# EAGLE design CommsTestBoard (EAGLE 9.6.2)
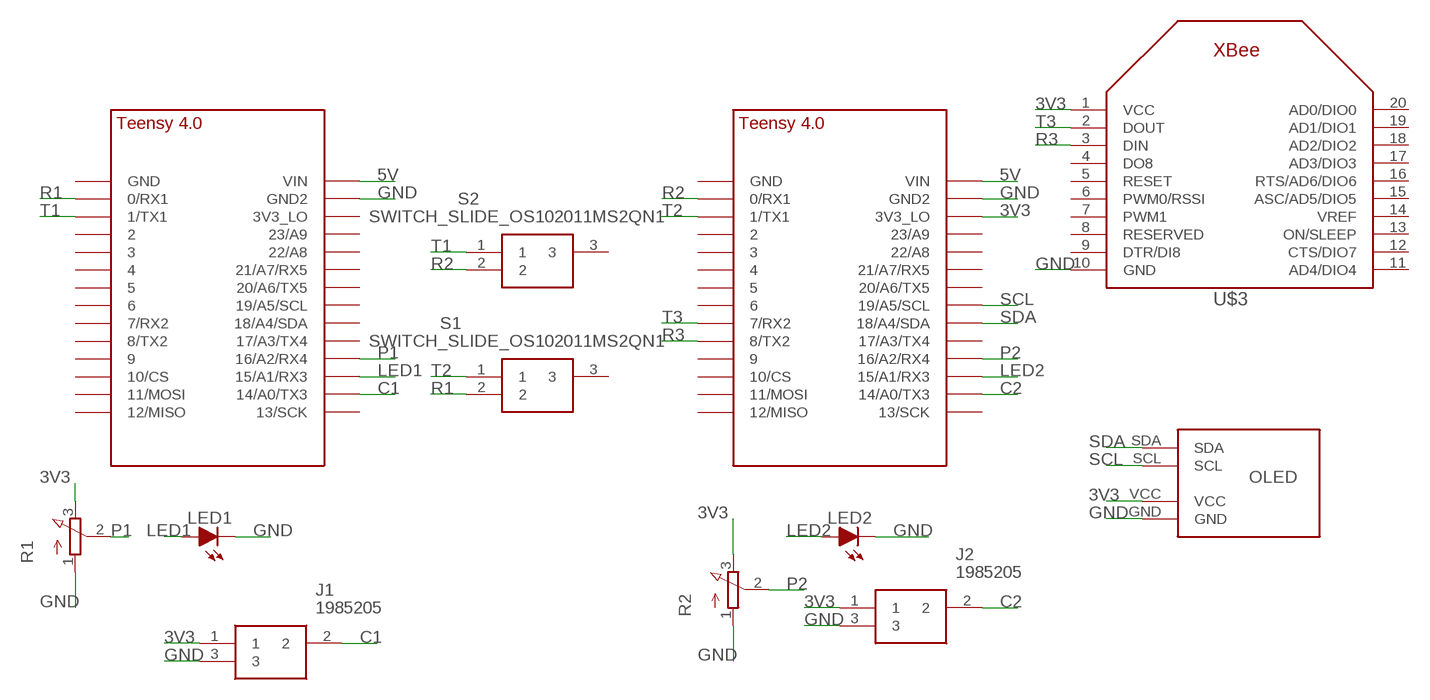
[diagram p0: schematic, sheet 1]

## Parts
J1  1985205  [1985205]
J2  1985205  [1985205]
LED1  LED-5MM  [LED-5MM]
LED2  LED-5MM  [LED-5MM]
R1  POTENTIOMETER  [3RP/1610N]
R2  POTENTIOMETER  [3RP/1610N]
S1  SWITCH_SLIDE_OS102011MS2QN1  [OS102011MA1QN1]
S2  SWITCH_SLIDE_OS102011MS2QN1  [OS102011MA1QN1]
U$1  TEENSY_4.0_SIMPLE  [TEENSY_4.0_SIMPLE]
U$2  TEENSY_4.0_SIMPLE  [TEENSY_4.0_SIMPLE]
U$3  XBEE  [XBEE]
U$4  OLED_SSD1306  [OLED_SSD1306]

## Nets
3V3: J1.1 J2.1 R1.3(E) R2.3(E) U$2.3V3_LO U$3.1(VCC) U$4.VCC
5V: U$1.VIN U$2.VIN
C1: J1.2 U$1.14/A0(14/A0/TX3)
C2: J2.2 U$2.14/A0(14/A0/TX3)
GND: J1.3 J2.3 LED1.K(C) LED2.K(C) R1.1(A) R2.1(A) U$1.GND2 U$2.GND2 U$3.10(GND) U$4.GND
LED1: LED1.A U$1.15/A1(15/A1/RX3)
LED2: LED2.A U$2.15/A1(15/A1/RX3)
P1: R1.2(S) U$1.16/A2(16/A2/RX4)
P2: R2.2(S) U$2.16/A2(16/A2/RX4)
R1: S1.2 U$1.0/RX(0/RX1)
R2: S2.2 U$2.0/RX(0/RX1)
R3: U$2.8(8/TX2) U$3.3(DIN)
SCL: U$2.19/A5/SCL U$4.SCL
SDA: U$2.18/A4/SDA U$4.SDA
T1: S2.1 U$1.1/TX(1/TX1)
T2: S1.1 U$2.1/TX(1/TX1)
T3: U$2.7(7/RX2) U$3.2(DOUT)
Unconnected: S1.3 S2.3 U$1.2 U$1.3/CANTX U$1.3V3_LO U$1.4/CANRX U$1.5 U$1.6 U$1.7(7/RX2) U$1.8(8/TX2) U$1.9/CS U$1.10/CS U$1.11/MOSI U$1.12/MISO U$1.13/SCK U$1.17/A3(17/A3/TX4) U$1.18/A4/SDA U$1.19/A5/SCL U$1.20/A6(20/A6/TX5) U$1.21/A7(21/A7/RX5) U$1.22/A8 U$1.23/A9 U$1.GND U$2.2 U$2.3/CANTX U$2.4/CANRX U$2.5 U$2.6 U$2.9/CS U$2.10/CS U$2.11/MOSI U$2.12/MISO U$2.13/SCK U$2.17/A3(17/A3/TX4) U$2.20/A6(20/A6/TX5) U$2.21/A7(21/A7/RX5) U$2.22/A8 U$2.23/A9 U$2.GND U$3.4(DO8) U$3.5(RESET) U$3.6(PWM0/RSSI) U$3.7(PWM1) U$3.8(RESERVED) U$3.9(DTR/DI8) U$3.11(AD4/DIO4) U$3.12(CTS/DIO7) U$3.13(ON/SLEEP) U$3.14(VREF) U$3.15(ASC/AD5/DIO5) U$3.16(RTS/AD6/DIO6) U$3.17(AD3/DIO3) U$3.18(AD2/DIO2) U$3.19(AD1/DIO1) U$3.20(AD0/DIO0)

## Library data of the parts
J1 J2 = GTOR - Connectors:1985205: Fixed Terminal Blocks PTSA 1.5/3-3.5-Z Source: Datasheet <https://componentsearchengine.com/Datasheets/1/1985205.pdf>; ARROW_PART_NUMBER: 1985205; ARROW_PRICE-STOCK: https://www.arrow.com/en/products/1985205/phoenix-contact; DESCRIPTION: Fixed Terminal Blocks PTSA 1.5/3-3.5-Z; HEIGHT: 13mm; MANUFACTURER_NAME: Phoenix Contact; MANUFACTURER_PART_NUMBER: 1985205; MOUSER_PART_NUMBER: 651-1985205; MOUSER_PRICE-STOCK: https://www.mouser.co.uk/ProductDetail/Phoenix-Contact/1985205?qs=JcjeNNoqGSNoFnucoMlHJQ%3D%3D
LED1 LED2 = GTOR - Passive Components:LED: Light Emitting Diode (LED) Source: Dangerous Prototypes Eagle Library <https://github.com/DangerousPrototypes/Eagle_Part_Library>
R1 R2 = GTOR - Passive Components:POTENTIOMETER: 16mm Potentiometer one level Source: http://www.alphapotentiometers.net/html/16mm_pot_2.html
S1 S2 = GTOR - Active Components:SWITCH_SLIDE_OS102011MS2QN1: Switch Slide Miniature SPDT 0.1A 12VDC Through Hole Slide Switch SPDT On-On 0.1 A@ 12 V dc Slide Source: Datasheet <http://www.ckswitches.com/media/1428/os.pdf>; ARROW_PART_NUMBER: OS102011MS2QN1; ARROW_PRICE-STOCK: https://www.arrow.com/en/products/os102011ms2qn1/ck; DESCRIPTION: Switch Slide Miniature SPDT 0.1A 12VDC Through Hole Slide Switch SPDT On-On 0.1 A@ 12 V dc Slide; HEIGHT: mm; MANUFACTURER_NAME: C & K COMPONENTS; MANUFACTURER_PART_NUMBER: OS102011MS2QN1; MOUSER_PART_NUMBER: 611-OS102011MS2QN1; MOUSER_PRICE-STOCK: https://www.mouser.co.uk/ProductDetail/CK/OS102011MS2QN1?qs=WtljUlYws5RvQ1hEv876nQ%3D%3D
U$1 U$2 = GTOR - Microcontroller:TEENSY_4.0_SIMPLE
U$3 = GTOR - Microcontroller:XBEE: Source: Adafruit <https://github.com/adafruit/Adafruit-Eagle-Library>
U$4 = GTOR - Breakout Boards:OLED_SSD1306

## Board
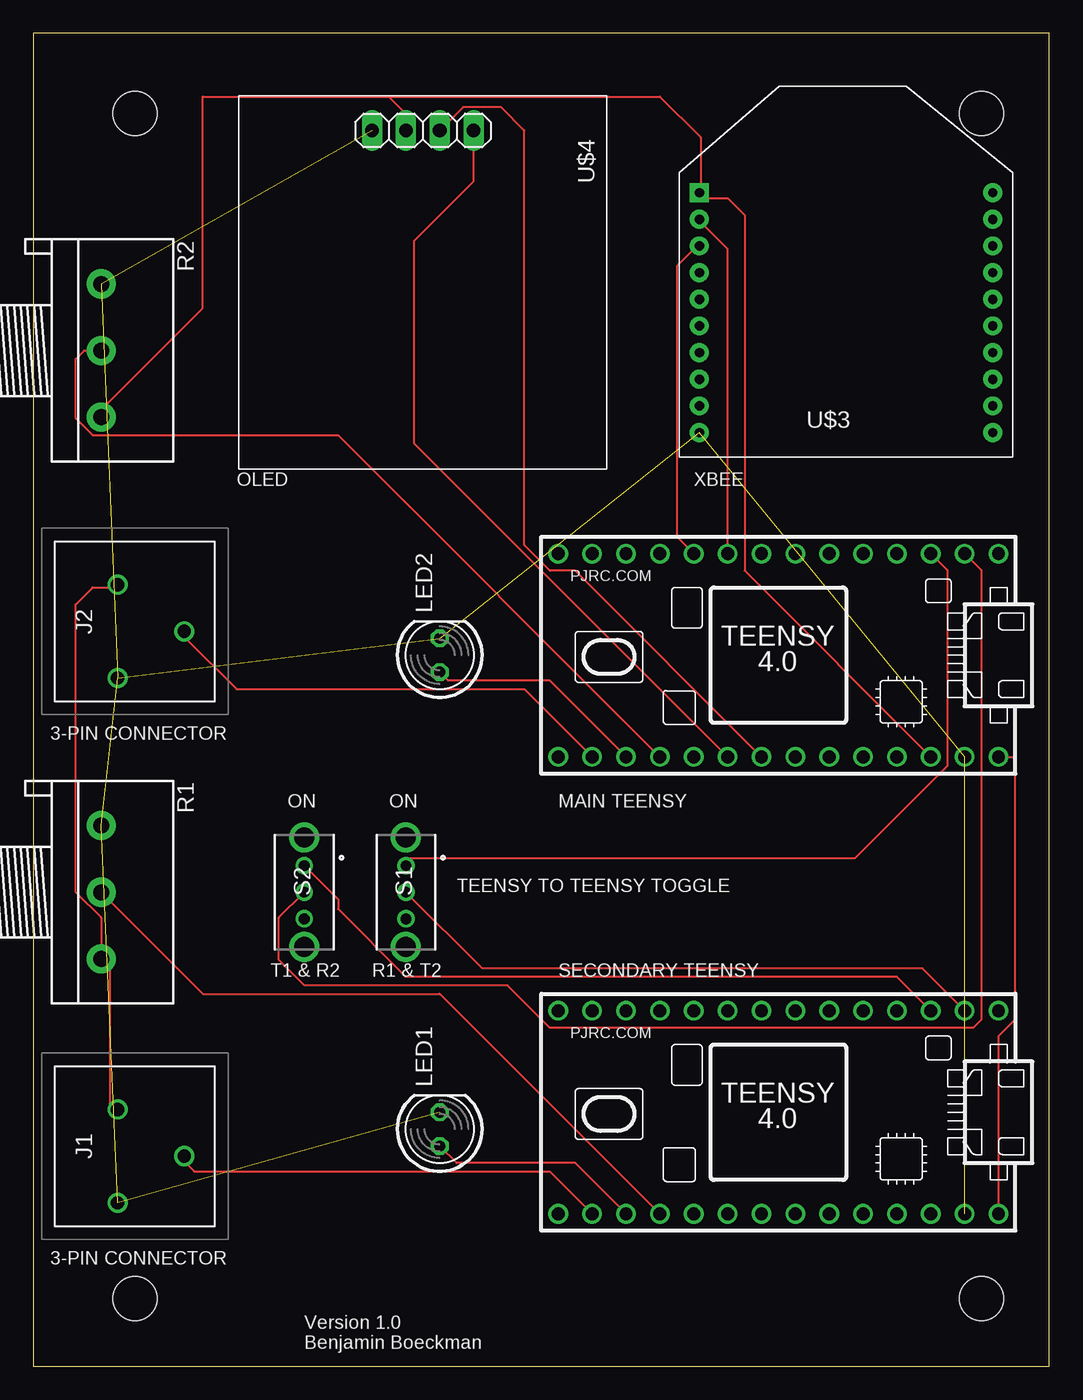
[diagram p1: board, top side]
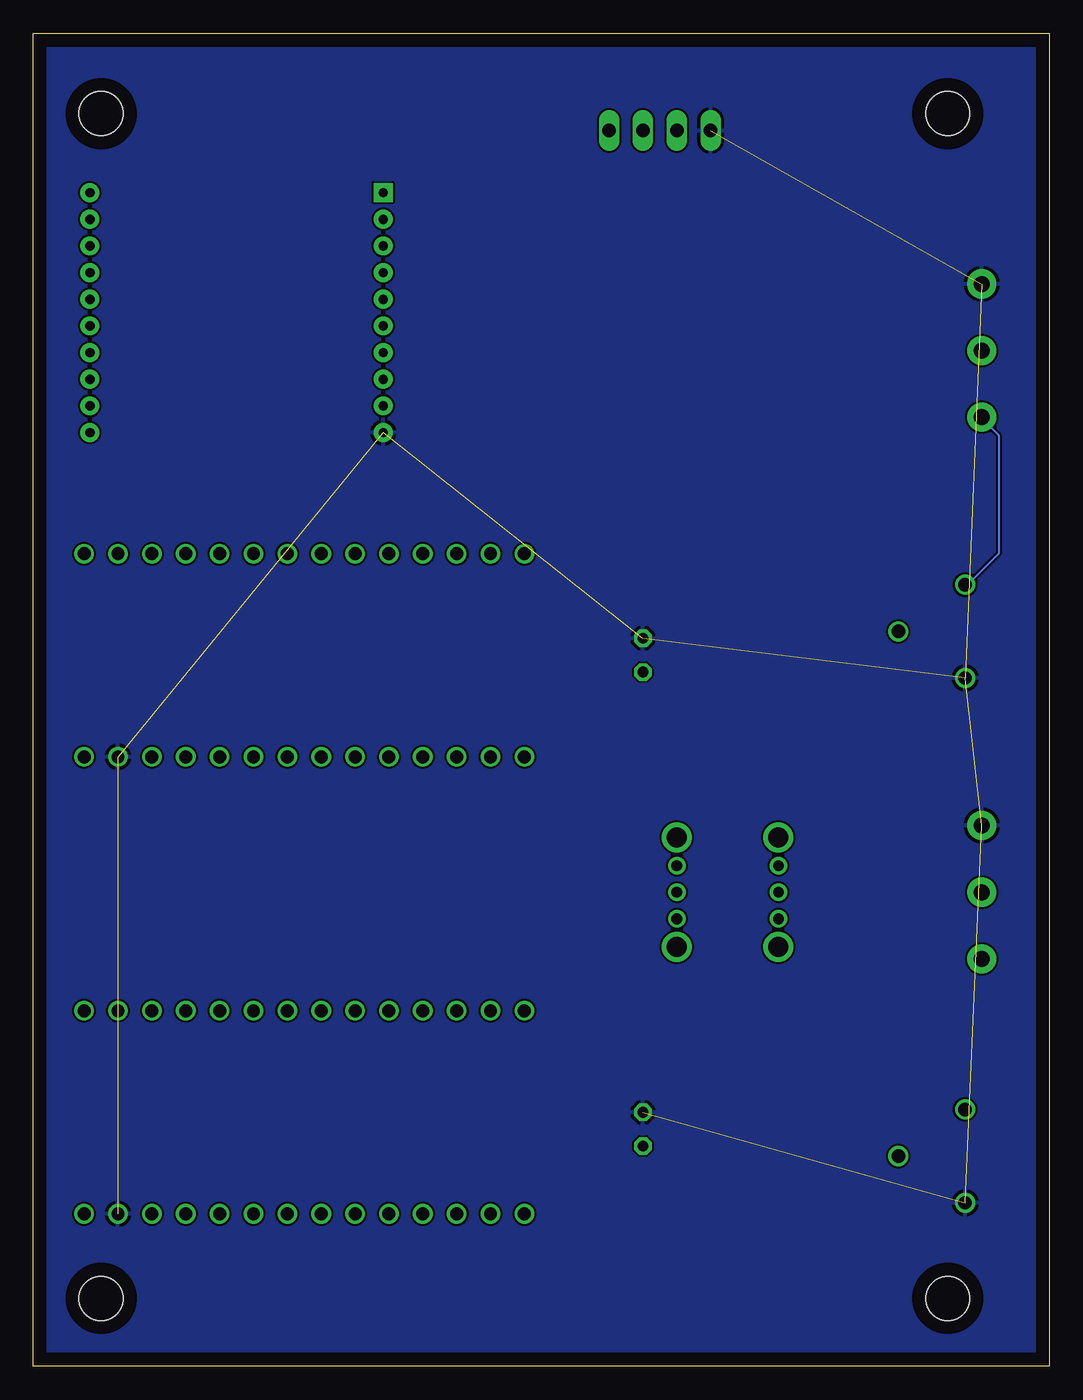
[diagram p2: board, bottom side, seen from below]

Size 76.2 x 100 mm. Coordinates in mm from the lower left corner, seen from the top.
Outline: 76.2,0 76.2,100 0,100 0,0 76.2,0
Copper layers (1*16): Top 0.035mm / dielectric 1.5mm / Bottom 0.035mm
Design rules "default": minimum track width 6mil, minimum drill 0.35mm, track to track 6mil, track to pad 6mil, pad to pad 6mil, via to via 6mil, smd to smd 6mil, copper to edge 40mil, drill to drill 6mil, minimum pad ring 10mil, minimum via ring 8mil, stop-mask expansion 4mil, vias tented up to drill 0mil, thermal gap 10mil
Holes 3.3 mm at 7.62,5.08 7.62,93.98 71.12,93.98 71.12,5.08

### Footprints (pad centres in the part's own frame; a part is rotated, then mirrored left to right if it is on the bottom)
1985205 = drill 1 pad 1.5: 1 -2.75,-1.3; 2 0.75,3.7; 3 4.25,-1.3
LED-5MM = drill 0.813 octagon: A -1.27,0; K 1.27,0
3RP/1610N = drill 1.2 pad 2.184: 1 -5,0; 2 0,0; 3 5,0
OS102011MA1QN1 = drill 0.8 pad 1.3: 1 -2,0; 2 0,0; 3 2,0 | drill 1.5 pad 2.25: 4 -4.1,0; 5 4.1,0
TEENSY_4.0_SIMPLE = drill 0.965: 0/RX -13.97,-7.62; 1/TX -11.43,-7.62; 2 -8.89,-7.62; 3/CANTX -6.35,-7.62; 3V3_LO -11.43,7.62; 4/CANRX -3.81,-7.62; 5 -1.27,-7.62; 6 1.27,-7.62; 7 3.81,-7.62; 8 6.35,-7.62; 9/CS 8.89,-7.62; 10/CS 11.43,-7.62; 11/MOSI 13.97,-7.62; 12/MISO 16.51,-7.62; 13/SCK 16.51,7.62; 14/A0 13.97,7.62; 15/A1 11.43,7.62; 16/A2 8.89,7.62; 17/A3 6.35,7.62; 18/A4/SDA 3.81,7.62; 19/A5/SCL 1.27,7.62; 20/A6 -1.27,7.62; 21/A7 -3.81,7.62; 22/A8 -6.35,7.62; 23/A9 -8.89,7.62; GND -16.51,-7.62; GND2 -13.97,7.62; VIN -16.51,7.62
XBEE = drill 0.7 pad 1.422 square: 1 -11,5.5 | drill 0.7 pad 1.422: 2 -11,3.5; 3 -11,1.5; 4 -11,-0.5; 5 -11,-2.5; 6 -11,-4.5; 7 -11,-6.5; 8 -11,-8.5; 9 -11,-10.5; 10 -11,-12.5; 11 11,-12.5; 12 11,-10.5; 13 11,-8.5; 14 11,-6.5; 15 11,-4.5; 16 11,-2.5; 17 11,-0.5; 18 11,1.5; 19 11,3.5; 20 11,5.5
OLED_SSD1306 = drill 1.016 long: GND 0,-3.81; SCL 0,1.27; SDA 0,3.81; VCC 0,-1.27

### Placement (x,y rotation side)
J1  7.62,16.51 270 top
J2  7.62,55.88 270 top
LED1  30.48,17.78 90 top
LED2  30.48,53.34 90 top
R1  5.08,35.56 270 top
R2  5.08,76.2 270 top
S1  27.94,35.56 270 top
S2  20.32,35.56 270 top
U$1  55.88,19.05 180 top
U$2  55.88,53.34 180 top
U$3  60.96,82.55 0 top
U$4  29.21,92.71 270 top

### Tracks (layer width: path | path; a pad name or v marks a point on that pad's centre or on a via)
3V3
  Top 0.152: J1.1 5.71,19.68 5.71,30.48 5.08,30.48 R1.3 5.08,33.66 3.17,35.56 3.17,57.15 4.45,58.42 5.71,58.42 J2.1 | 49.53,87.63 U$3.1 50.04,87.88 | U$2.3V3_LO 53.34,59.69 53.34,86.36 52.07,87.63 50.16,87.63 50.04,87.88 | R2.3 5.08,71.75 12.7,79.38 12.7,95.25 26.67,95.25 | 26.67,95.25 46.99,95.25 50.04,92.2 50.04,87.88 | 26.67,95.25 27.94,93.98 U$4.VCC
  Bottom 0.152: J2.1 5.71,59.05 3.81,60.96 3.81,69.85 5.08,71.12 R2.3
5V
  Top 0.152: U$2.VIN 73.66,45.72 73.66,26.04 72.39,24.77 U$1.VIN
C1
  Top 0.152: U$1.14/A0 38.73,14.61 12.06,14.61 11.43,15.24 J1.2
C2
  Top 0.152: U$2.14/A0 36.83,50.8 15.24,50.8 11.43,54.61 J2.2
GND  (9 unrouted)
  pour Bottom: 0,0 76.2,0 76.2,100.33 0,100.33
LED1
  Top 0.152: LED1.A 31.75,15.24 40.64,15.24 U$1.15/A1
LED2
  Top 0.152: LED2.A 31.11,51.44 38.73,51.44 U$2.15/A1
P1
  Top 0.152: U$1.16/A2 30.48,27.94 12.7,27.94 R1.2
P2
  Top 0.152: U$2.16/A2 22.86,69.85 4.45,69.85 3.17,71.12 3.17,75.56 3.81,76.2 R2.2
R1
  Top 0.152: S1.2 33.66,29.84 66.67,29.84 U$1.0/RX
R2
  Top 0.152: S2.2 18.41,33.66 18.41,30.48 20.32,28.57 35.56,28.57 38.73,25.4 70.48,25.4 71.12,26.04 71.12,59.69 U$2.0/RX
R3
  Top 0.152: U$3.3 49.53,83.82 48.26,82.55 48.26,62.23 U$2.8
SCL
  Top 0.152: U$2.19/A5/SCL 40.64,59.69 38.73,59.69 36.83,61.59 36.83,92.71 35.08,94.46 32.23,94.46 U$4.SCL
SDA
  Top 0.152: U$2.18/A4/SDA 28.57,69.22 28.57,84.45 33.02,88.9 U$4.SDA
T1
  Top 0.152: U$1.1/TX 64.77,29.21 27.94,29.21 22.86,34.29 22.86,35.02 S2.1
T2
  Top 0.152: S1.1 27.94,38.1 61.59,38.1 68.58,45.09 68.58,59.69 U$2.1/TX
T3
  Top 0.152: U$2.7 52.07,83.82 50.16,85.72 U$3.2

### Text on the board
tPlace: OLED | XBEE | 3-PIN CONNECTOR | ON | ON | MAIN TEENSY | TEENSY TO TEENSY TOGGLE | T1 & R2 | R1 & T2 | SECONDARY TEENSY | 3-PIN CONNECTOR | Version 1.0 / Benjamin Boeckman